# EAGLE design schema (EAGLE 6.6.0)
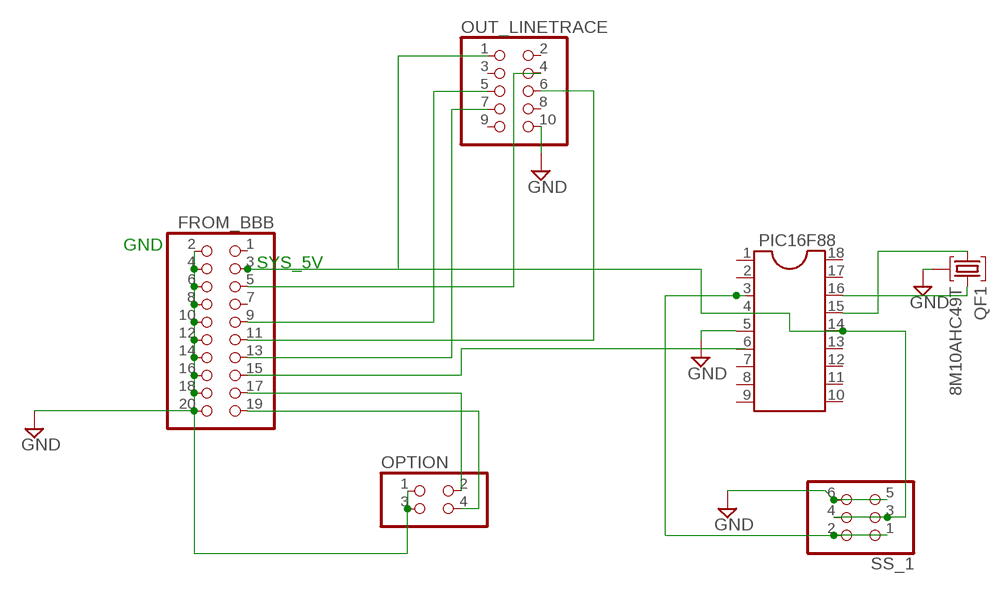
[diagram p0: schematic, sheet 1]

## Parts
FROM_BBB  PINHD-2X10  [2X10]
OPTION  PINHD-2X2  [2X02]
OUT_LINETRACE  PINHD-2X5  [2X05]
PIC16F88  DIL18S  [SOCKET-18]
QF1  8M10AHC49T  [HC49U]
SS_1  PINHD-2X3  [2X03]

## Nets
GND: FROM_BBB.2 FROM_BBB.4 FROM_BBB.6 FROM_BBB.8 FROM_BBB.10 FROM_BBB.12 FROM_BBB.14 FROM_BBB.16 FROM_BBB.18 FROM_BBB.20 OPTION.1 OPTION.3 OUT_LINETRACE.10 PIC16F88.5 QF1.2 SS_1.5 SS_1.6
N$1: FROM_BBB.5 OUT_LINETRACE.4
N$2: FROM_BBB.9 OUT_LINETRACE.5
N$3: FROM_BBB.11 OUT_LINETRACE.6
N$4: FROM_BBB.13 OUT_LINETRACE.7
N$5: PIC16F88.3 SS_1.1 SS_1.2
N$6: FROM_BBB.3 OUT_LINETRACE.1 PIC16F88.4 PIC16F88.14 SS_1.3 SS_1.4
N$7: PIC16F88.15 QF1.1
N$8: PIC16F88.16 QF1.3
N$9: FROM_BBB.15
N$10: FROM_BBB.17 OPTION.2
N$11: FROM_BBB.19 OPTION.4
Unconnected: FROM_BBB.1 FROM_BBB.7 OUT_LINETRACE.2 OUT_LINETRACE.3 OUT_LINETRACE.8 OUT_LINETRACE.9 PIC16F88.1 PIC16F88.2 PIC16F88.6 PIC16F88.7 PIC16F88.8 PIC16F88.9 PIC16F88.10 PIC16F88.11 PIC16F88.12 PIC16F88.13 PIC16F88.17 PIC16F88.18

## Notes on the sheet
- GND
- SYS_5V

## Library data of the parts
FROM_BBB = pinhead:PINHD-2X10: PIN HEADER
OPTION = pinhead:PINHD-2X2: PIN HEADER
OUT_LINETRACE = pinhead:PINHD-2X5: PIN HEADER
PIC16F88 = ic-package:DIL18: Dual In Line / Socket
QF1 = crystal:8M10AHC49T: Monolithic Crystal Filters Source: www.vanlong.com; OC_FARNELL: unknown; OC_NEWARK: unknown
SS_1 = pinhead:PINHD-2X3: PIN HEADER

## Board
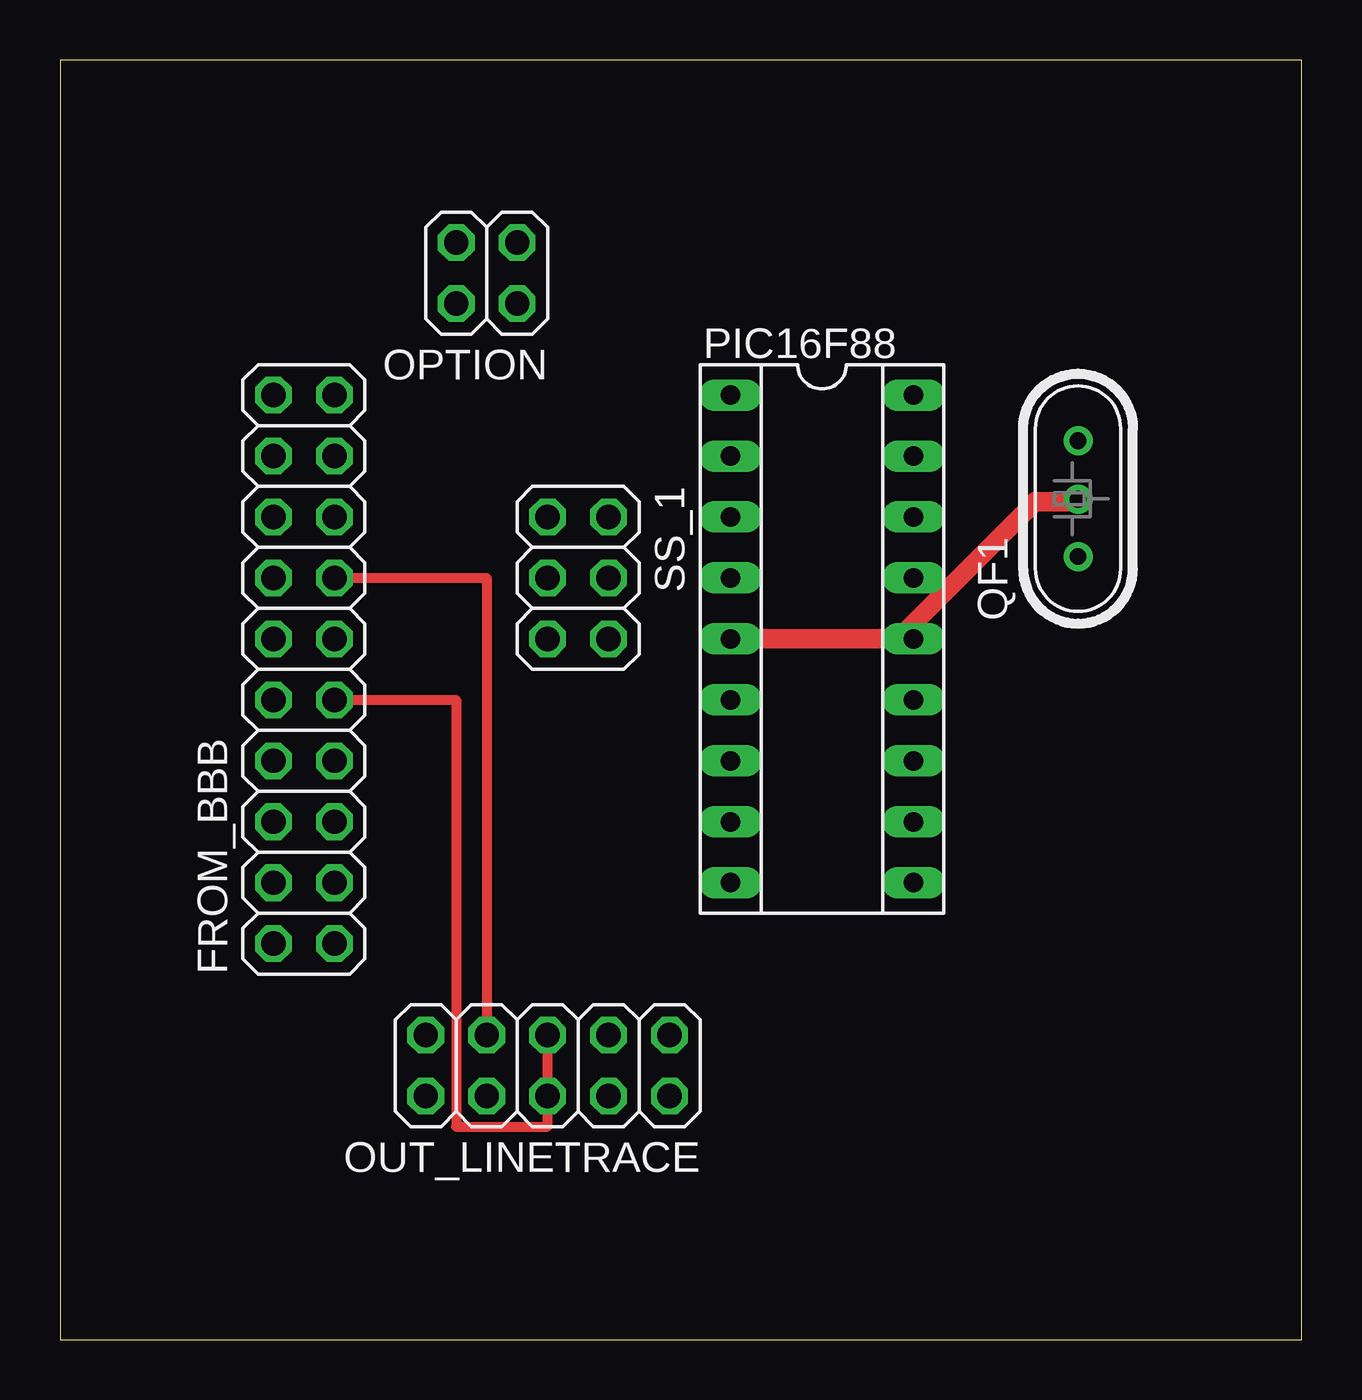
[diagram p1: board, top side]
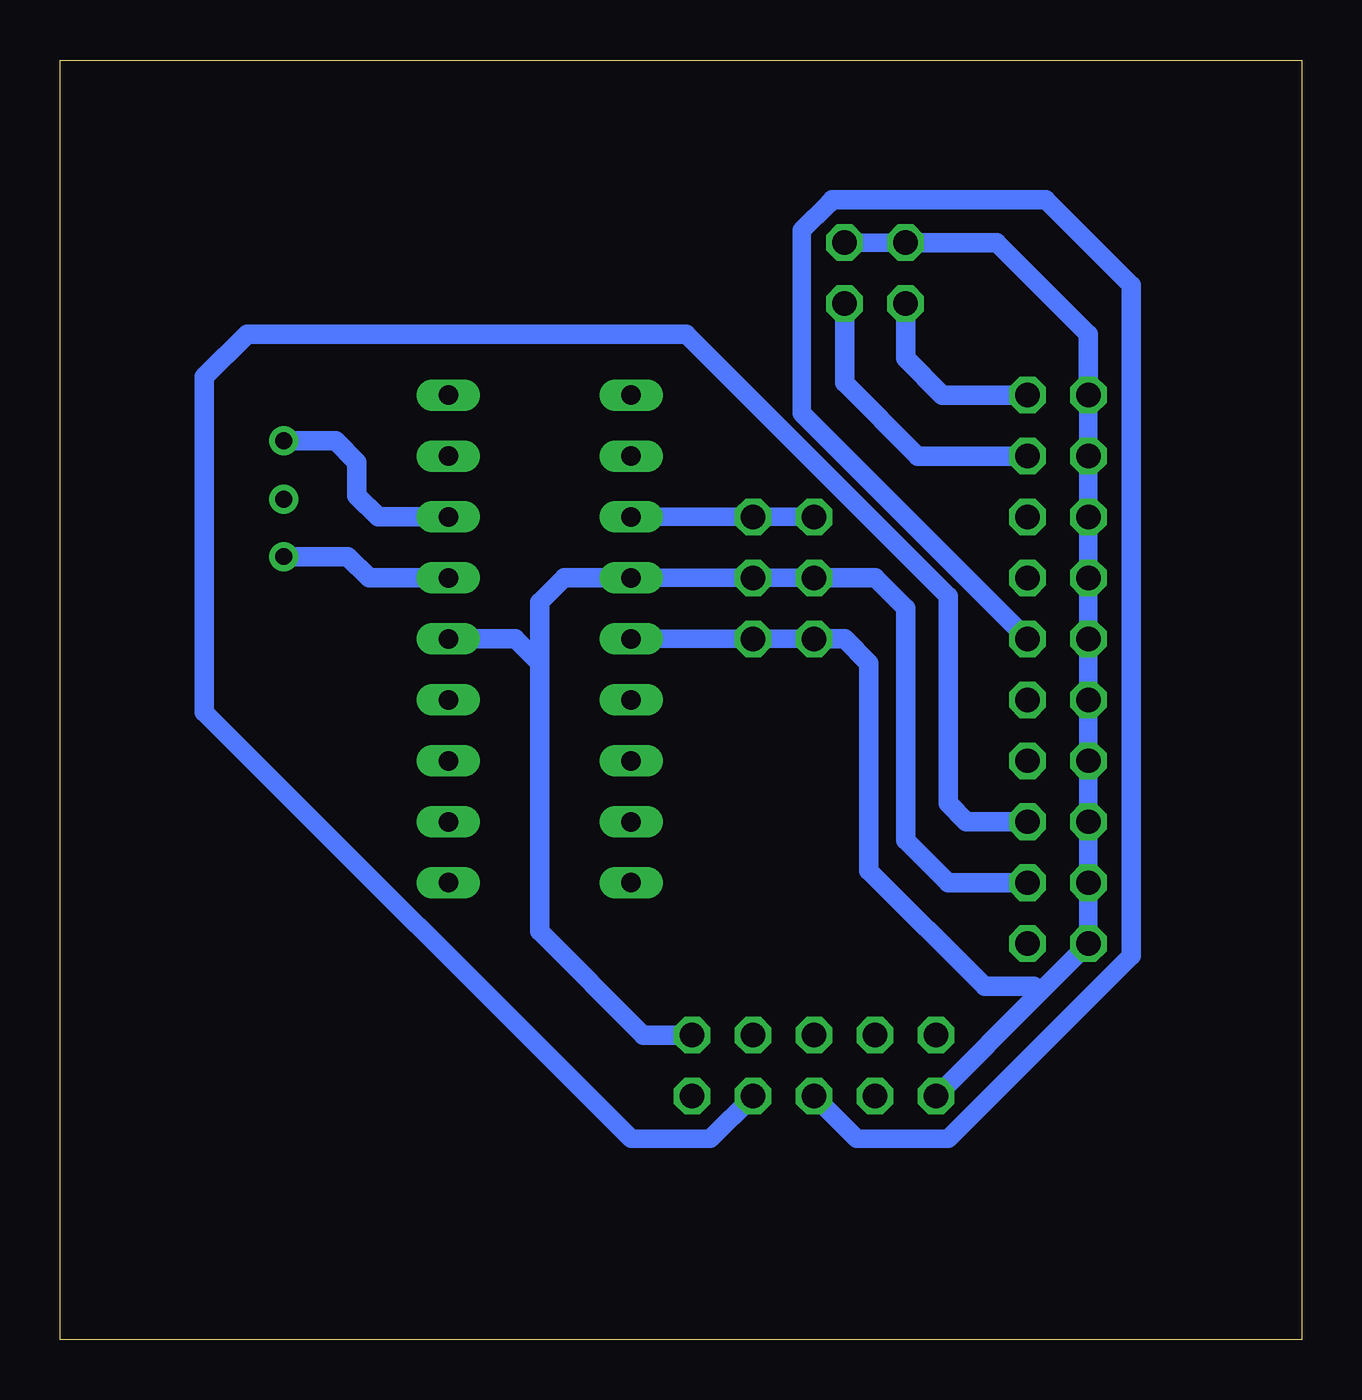
[diagram p2: board, bottom side, seen from below]

Size 51.74 x 53.33 mm. Coordinates in mm from the lower left corner, seen from the top.
Outline: 0,0 51.74,0 51.74,53.33 0,53.33 0,0
Copper layers (1*16): Top 0.035mm / dielectric 1.5mm / Bottom 0.035mm
Design rules "default *": minimum track width 30mil, minimum drill 24mil, track to track 8mil, track to pad 8mil, pad to pad 8mil, via to via 8mil, smd to smd 8mil, copper to edge 40mil, drill to drill 8mil, minimum pad ring 10mil, minimum via ring 8mil, stop-mask expansion 4mil, vias tented up to drill 0mil, thermal gap 10mil

### Footprints (pad centres in the part's own frame; a part is rotated, then mirrored left to right if it is on the bottom)
2X10 = drill 1.016 octagon: 1 -11.43,-1.27; 2 -11.43,1.27; 3 -8.89,-1.27; 4 -8.89,1.27; 5 -6.35,-1.27; 6 -6.35,1.27; 7 -3.81,-1.27; 8 -3.81,1.27; 9 -1.27,-1.27; 10 -1.27,1.27; 11 1.27,-1.27; 12 1.27,1.27; 13 3.81,-1.27; 14 3.81,1.27; 15 6.35,-1.27; 16 6.35,1.27; 17 8.89,-1.27; 18 8.89,1.27; 19 11.43,-1.27; 20 11.43,1.27
2X02 = drill 1.016 octagon: 1 -1.27,-1.27; 2 -1.27,1.27; 3 1.27,-1.27; 4 1.27,1.27
2X05 = drill 1.016 octagon: 1 -5.08,-1.27; 2 -5.08,1.27; 3 -2.54,-1.27; 4 -2.54,1.27; 5 0,-1.27; 6 0,1.27; 7 2.54,-1.27; 8 2.54,1.27; 9 5.08,-1.27; 10 5.08,1.27
SOCKET-18 = drill 0.813 long: 1 -10.16,-3.81; 2 -7.62,-3.81; 3 -5.08,-3.81; 4 -2.54,-3.81; 5 0,-3.81; 6 2.54,-3.81; 7 5.08,-3.81; 8 7.62,-3.81; 9 10.16,-3.81; 10 10.16,3.81; 11 7.62,3.81; 12 5.08,3.81; 13 2.54,3.81; 14 0,3.81; 15 -2.54,3.81; 16 -5.08,3.81; 17 -7.62,3.81; 18 -10.16,3.81
HC49U = drill 0.7 pad 1.2: 1 -2.413,0; 2 -0.027,0; 3 2.413,0
2X03 = drill 1.016 octagon: 1 -2.54,-1.27; 2 -2.54,1.27; 3 0,-1.27; 4 0,1.27; 5 2.54,-1.27; 6 2.54,1.27

### Placement (x,y rotation side)
FROM_BBB  10.16,27.94 90 top
OPTION  17.78,44.45 180 top
OUT_LINETRACE  20.32,11.43 180 top
PIC16F88  31.75,29.21 270 top
QF1  42.42,35.05 90 top
SS_1  21.59,31.75 270 top

### Tracks (layer width: path | path; a pad name or v marks a point on that pad's centre or on a via)
GND
  Top 0.813: PIC16F88.5 34.92,29.21 40.64,34.92 42.32,34.92 QF1.2
  Bottom 0.762: PIC16F88.5 SS_1.6 SS_1.5 | OPTION.1 OPTION.3 | 10.92,14.48 FROM_BBB.2 FROM_BBB.4 FROM_BBB.6 FROM_BBB.8 FROM_BBB.10 FROM_BBB.12 FROM_BBB.14 FROM_BBB.16 FROM_BBB.18 FROM_BBB.20 | 10.92,14.48 OUT_LINETRACE.10 | 11.18,14.73 10.92,14.48
  Bottom 0.813: FROM_BBB.20 8.89,41.91 12.7,45.72 OPTION.3 | 11.18,14.73 13.21,14.73 18.03,19.56 18.03,28.19 19.05,29.21 SS_1.5
N$1
  Bottom 0.762: OUT_LINETRACE.4 24.64,8.38 27.94,8.38 45.72,26.16
  Bottom 0.813: FROM_BBB.5 13.97,21.59 14.73,22.35 14.73,30.99 25.65,41.91 43.94,41.91 45.72,40.13 45.72,26.16
N$2
  Top 0.406: FROM_BBB.9 16.51,26.67 16.51,8.89 20.32,8.89 OUT_LINETRACE.5
N$3
  Bottom 0.762: OUT_LINETRACE.6 18.54,8.38 14.73,8.38 7.11,16 | 19.68,47.37 20.83,46.23 20.83,38.61 FROM_BBB.11
  Bottom 0.813: 7.11,16 7.11,43.94 10.67,47.5 19.56,47.5 19.68,47.37
N$4
  Top 0.406: FROM_BBB.13 17.78,31.75 OUT_LINETRACE.7
N$5
  Bottom 0.762: PIC16F88.3 SS_1.2 SS_1.1
N$6
  Bottom 0.762: PIC16F88.4 SS_1.4 SS_1.3 | 35.31,28.96 PIC16F88.14
  Bottom 0.813: FROM_BBB.3 14.73,19.05 16.51,20.83 16.51,30.48 17.78,31.75 SS_1.3 | OUT_LINETRACE.1 27.43,12.7 31.75,17.02 31.75,28.19 | 31.75,28.19 32.77,29.21 PIC16F88.14 | PIC16F88.4 30.73,31.75 31.75,30.73 31.75,28.19
N$7
  Bottom 0.813: PIC16F88.15 38.86,31.75 39.75,32.64 QF1.1
N$8
  Bottom 0.813: PIC16F88.16 38.48,34.29 39.37,35.18 39.37,36.58 40.26,37.47 QF1.3
N$10
  Bottom 0.813: FROM_BBB.17 16,36.83 19.05,39.88 OPTION.2
N$11
  Bottom 0.813: FROM_BBB.19 14.99,39.37 16.51,40.89 OPTION.4

### Text on the board
Document: 1 | 1 | 1 | 1 | 1